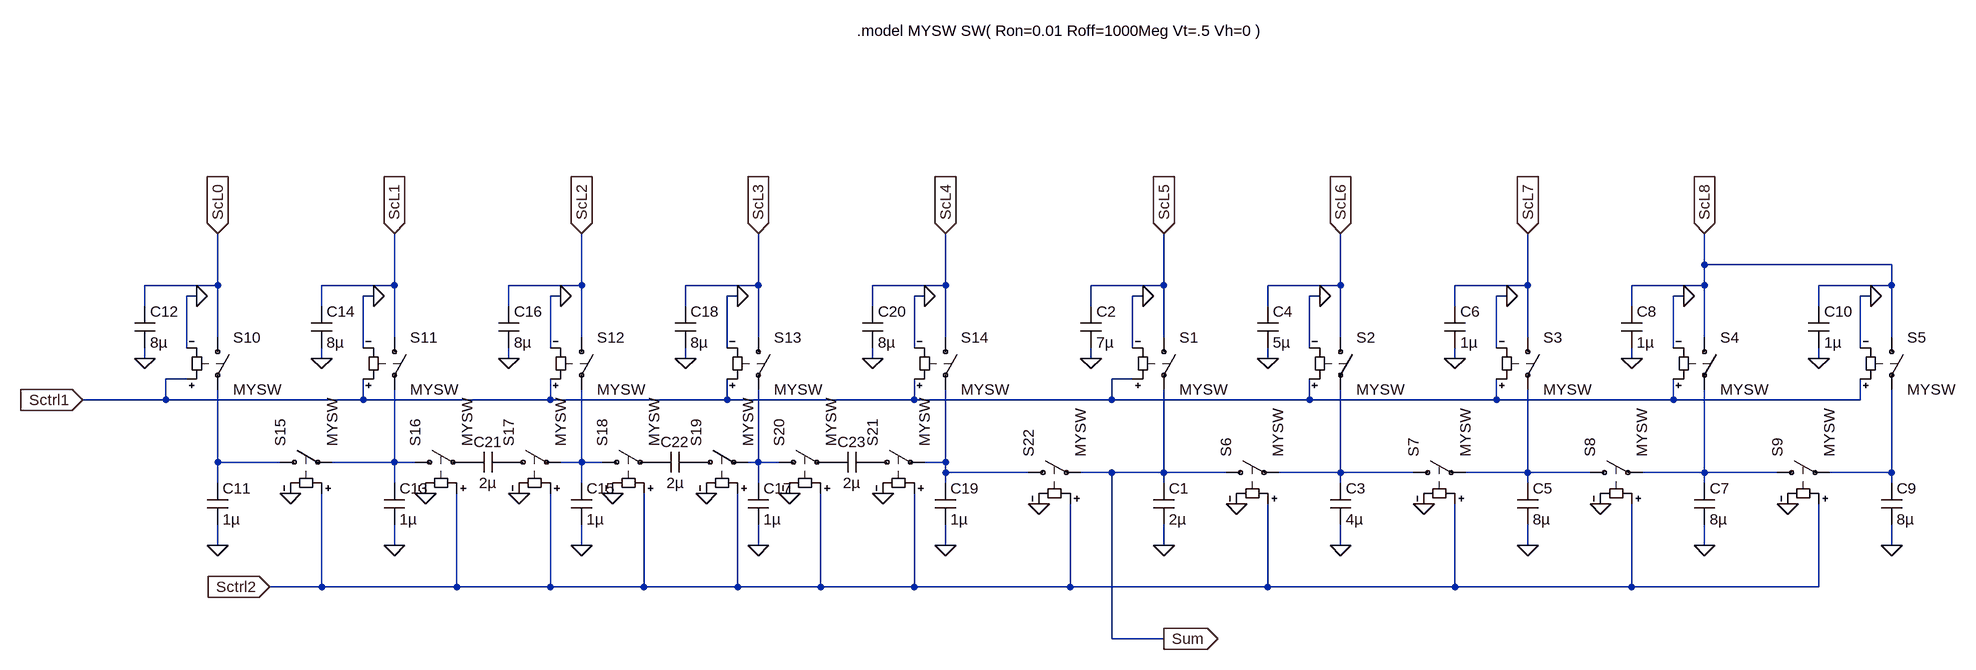
[diagram p0: schematic leafmod.asc]
leafmod.asc, the LTspice schematic file:
Version 4
SHEET 1 1396 680
WIRE 1008 -192 1008 -240
WIRE 1296 -192 1008 -192
WIRE -1280 -160 -1280 -240
WIRE -1280 -160 -1392 -160
WIRE -1008 -160 -1008 -240
WIRE -1008 -160 -1120 -160
WIRE -720 -160 -720 -240
WIRE -720 -160 -832 -160
WIRE -448 -160 -448 -240
WIRE -448 -160 -560 -160
WIRE -160 -160 -160 -240
WIRE -160 -160 -272 -160
WIRE 176 -160 176 -240
WIRE 176 -160 64 -160
WIRE 448 -160 448 -240
WIRE 448 -160 336 -160
WIRE 736 -160 736 -240
WIRE 736 -160 624 -160
WIRE 1008 -160 1008 -192
WIRE 1008 -160 896 -160
WIRE 1296 -160 1296 -192
WIRE 1296 -160 1184 -160
WIRE -1312 -144 -1328 -144
WIRE -1040 -144 -1056 -144
WIRE -752 -144 -768 -144
WIRE -480 -144 -496 -144
WIRE -192 -144 -208 -144
WIRE 144 -144 128 -144
WIRE 416 -144 400 -144
WIRE 704 -144 688 -144
WIRE 976 -144 960 -144
WIRE 1264 -144 1248 -144
WIRE -1392 -128 -1392 -160
WIRE -1120 -128 -1120 -160
WIRE -832 -128 -832 -160
WIRE -560 -128 -560 -160
WIRE -272 -128 -272 -160
WIRE 64 -128 64 -160
WIRE 336 -128 336 -160
WIRE 624 -128 624 -160
WIRE 896 -128 896 -160
WIRE 1184 -128 1184 -160
WIRE -1280 -80 -1280 -160
WIRE -1008 -80 -1008 -160
WIRE -720 -80 -720 -160
WIRE -448 -80 -448 -160
WIRE -160 -80 -160 -160
WIRE 176 -80 176 -160
WIRE 448 -80 448 -160
WIRE 736 -80 736 -160
WIRE 1008 -80 1008 -160
WIRE 1296 -80 1296 -160
WIRE -1328 -64 -1328 -144
WIRE -1056 -64 -1056 -144
WIRE -768 -64 -768 -144
WIRE -496 -64 -496 -144
WIRE -208 -64 -208 -144
WIRE 128 -64 128 -144
WIRE 400 -64 400 -144
WIRE 688 -64 688 -144
WIRE 960 -64 960 -144
WIRE 1248 -64 1248 -144
WIRE -1392 -48 -1392 -64
WIRE -1120 -48 -1120 -64
WIRE -832 -48 -832 -64
WIRE -560 -48 -560 -64
WIRE -272 -48 -272 -64
WIRE 64 -48 64 -64
WIRE 336 -48 336 -64
WIRE 624 -48 624 -64
WIRE 896 -48 896 -64
WIRE 1184 -48 1184 -64
WIRE -1328 -16 -1360 -16
WIRE 128 -16 96 -16
WIRE -1360 16 -1360 -16
WIRE -1360 16 -1488 16
WIRE -1056 16 -1056 -16
WIRE -1056 16 -1360 16
WIRE -768 16 -768 -16
WIRE -768 16 -1056 16
WIRE -496 16 -496 -16
WIRE -496 16 -768 16
WIRE -208 16 -208 -16
WIRE -208 16 -496 16
WIRE 96 16 96 -16
WIRE 96 16 -208 16
WIRE 400 16 400 -16
WIRE 400 16 96 16
WIRE 688 16 688 -16
WIRE 688 16 400 16
WIRE 960 16 960 -16
WIRE 960 16 688 16
WIRE 1248 16 1248 -16
WIRE 1248 16 960 16
WIRE -1280 112 -1280 0
WIRE -1184 112 -1280 112
WIRE -1008 112 -1008 0
WIRE -1008 112 -1104 112
WIRE -976 112 -1008 112
WIRE -720 112 -720 0
WIRE -720 112 -752 112
WIRE -688 112 -720 112
WIRE -448 112 -448 0
WIRE -448 112 -464 112
WIRE -416 112 -448 112
WIRE -160 112 -160 0
WIRE -160 112 -192 112
WIRE -160 128 -160 112
WIRE -32 128 -160 128
WIRE 96 128 48 128
WIRE 176 128 176 0
WIRE 176 128 96 128
WIRE 272 128 176 128
WIRE 448 128 448 0
WIRE 448 128 352 128
WIRE 560 128 448 128
WIRE 736 128 736 0
WIRE 736 128 640 128
WIRE 832 128 736 128
WIRE 1008 128 1008 0
WIRE 1008 128 912 128
WIRE 1120 128 1008 128
WIRE 1296 128 1296 0
WIRE 1296 128 1200 128
WIRE -1280 144 -1280 112
WIRE -1008 144 -1008 112
WIRE -720 144 -720 112
WIRE -448 144 -448 112
WIRE -160 144 -160 128
WIRE 176 144 176 128
WIRE 448 144 448 128
WIRE 736 144 736 128
WIRE 1008 144 1008 128
WIRE 1296 144 1296 128
WIRE -1280 240 -1280 208
WIRE -1008 240 -1008 208
WIRE -720 240 -720 208
WIRE -448 240 -448 208
WIRE -160 240 -160 208
WIRE 176 240 176 208
WIRE 448 240 448 208
WIRE 736 240 736 208
WIRE 1008 240 1008 208
WIRE 1296 240 1296 208
WIRE -1120 304 -1120 160
WIRE -1120 304 -1200 304
WIRE -912 304 -912 160
WIRE -912 304 -1120 304
WIRE -768 304 -768 160
WIRE -768 304 -912 304
WIRE -624 304 -624 160
WIRE -624 304 -768 304
WIRE -480 304 -480 160
WIRE -480 304 -624 304
WIRE -352 304 -352 160
WIRE -352 304 -480 304
WIRE -208 304 -208 160
WIRE -208 304 -352 304
WIRE 32 304 32 176
WIRE 32 304 -208 304
WIRE 336 304 336 176
WIRE 336 304 32 304
WIRE 624 304 624 176
WIRE 624 304 336 304
WIRE 896 304 896 176
WIRE 896 304 624 304
WIRE 1184 304 1184 176
WIRE 1184 304 896 304
WIRE 96 384 96 128
WIRE 176 384 96 384
FLAG 64 -48 0
FLAG 176 240 0
FLAG 144 -144 0
FLAG 336 -48 0
FLAG 448 240 0
FLAG 416 -144 0
FLAG 624 -48 0
FLAG 736 240 0
FLAG 704 -144 0
FLAG 896 -48 0
FLAG 1008 240 0
FLAG 976 -144 0
FLAG 1184 -48 0
FLAG 1296 240 0
FLAG 1264 -144 0
FLAG 288 176 0
FLAG 576 176 0
FLAG 848 176 0
FLAG 1136 176 0
FLAG -1392 -48 0
FLAG -1280 240 0
FLAG -1312 -144 0
FLAG -1120 -48 0
FLAG -1008 240 0
FLAG -1040 -144 0
FLAG -832 -48 0
FLAG -720 240 0
FLAG -752 -144 0
FLAG -560 -48 0
FLAG -448 240 0
FLAG -480 -144 0
FLAG -272 -48 0
FLAG -160 240 0
FLAG -192 -144 0
FLAG -1168 160 0
FLAG -960 160 0
FLAG -816 160 0
FLAG -672 160 0
FLAG -528 160 0
FLAG -400 160 0
FLAG -256 160 0
FLAG -16 176 0
FLAG -1280 -240 ScL0
IOPIN -1280 -240 In
FLAG -1008 -240 ScL1
IOPIN -1008 -240 In
FLAG -720 -240 ScL2
IOPIN -720 -240 In
FLAG -448 -240 ScL3
IOPIN -448 -240 In
FLAG -160 -240 ScL4
IOPIN -160 -240 In
FLAG 176 -240 ScL5
IOPIN 176 -240 In
FLAG 448 -240 ScL6
IOPIN 448 -240 In
FLAG 736 -240 ScL7
IOPIN 736 -240 In
FLAG 1008 -240 ScL8
IOPIN 1008 -240 In
FLAG -1488 16 Sctrl1
IOPIN -1488 16 In
FLAG -1200 304 Sctrl2
IOPIN -1200 304 In
FLAG 176 384 Sum
IOPIN 176 384 Out
SYMBOL cap 160 144 R0
SYMATTR InstName C1
SYMATTR Value 2µ
SYMBOL cap 48 -128 R0
SYMATTR InstName C2
SYMATTR Value 7µ
SYMBOL sw 176 -96 R0
SYMATTR InstName S1
SYMATTR Value MYSW
SYMBOL cap 432 144 R0
SYMATTR InstName C3
SYMATTR Value 4µ
SYMBOL cap 320 -128 R0
SYMATTR InstName C4
SYMATTR Value 5µ
SYMBOL sw 448 -96 R0
SYMATTR InstName S2
SYMATTR Value MYSW
SYMBOL cap 720 144 R0
SYMATTR InstName C5
SYMATTR Value 8µ
SYMBOL cap 608 -128 R0
SYMATTR InstName C6
SYMATTR Value 1µ
SYMBOL sw 736 -96 R0
SYMATTR InstName S3
SYMATTR Value MYSW
SYMBOL cap 992 144 R0
SYMATTR InstName C7
SYMATTR Value 8µ
SYMBOL cap 880 -128 R0
SYMATTR InstName C8
SYMATTR Value 1µ
SYMBOL sw 1008 -96 R0
SYMATTR InstName S4
SYMATTR Value MYSW
SYMBOL cap 1280 144 R0
SYMATTR InstName C9
SYMATTR Value 8µ
SYMBOL cap 1168 -128 R0
SYMATTR InstName C10
SYMATTR Value 1µ
SYMBOL sw 1296 -96 R0
SYMATTR InstName S5
SYMATTR Value MYSW
SYMBOL sw 256 128 R270
SYMATTR InstName S6
SYMATTR Value MYSW
SYMBOL sw 544 128 R270
SYMATTR InstName S7
SYMATTR Value MYSW
SYMBOL sw 816 128 R270
SYMATTR InstName S8
SYMATTR Value MYSW
SYMBOL sw 1104 128 R270
SYMATTR InstName S9
SYMATTR Value MYSW
SYMBOL cap -1296 144 R0
SYMATTR InstName C11
SYMATTR Value 1µ
SYMBOL cap -1408 -128 R0
SYMATTR InstName C12
SYMATTR Value 8µ
SYMBOL sw -1280 -96 R0
SYMATTR InstName S10
SYMATTR Value MYSW
SYMBOL cap -1024 144 R0
SYMATTR InstName C13
SYMATTR Value 1µ
SYMBOL cap -1136 -128 R0
SYMATTR InstName C14
SYMATTR Value 8µ
SYMBOL sw -1008 -96 R0
SYMATTR InstName S11
SYMATTR Value MYSW
SYMBOL cap -736 144 R0
SYMATTR InstName C15
SYMATTR Value 1µ
SYMBOL cap -848 -128 R0
SYMATTR InstName C16
SYMATTR Value 8µ
SYMBOL sw -720 -96 R0
SYMATTR InstName S12
SYMATTR Value MYSW
SYMBOL cap -464 144 R0
SYMATTR InstName C17
SYMATTR Value 1µ
SYMBOL cap -576 -128 R0
SYMATTR InstName C18
SYMATTR Value 8µ
SYMBOL sw -448 -96 R0
SYMATTR InstName S13
SYMATTR Value MYSW
SYMBOL cap -176 144 R0
SYMATTR InstName C19
SYMATTR Value 1µ
SYMBOL cap -288 -128 R0
SYMATTR InstName C20
SYMATTR Value 8µ
SYMBOL sw -160 -96 R0
SYMATTR InstName S14
SYMATTR Value MYSW
SYMBOL sw -1200 112 R270
SYMATTR InstName S15
SYMATTR Value MYSW
SYMBOL sw -992 112 R270
SYMATTR InstName S16
SYMATTR Value MYSW
SYMBOL cap -832 96 R90
WINDOW 0 0 32 VBottom 2
WINDOW 3 32 32 VTop 2
SYMATTR InstName C21
SYMATTR Value 2µ
SYMBOL sw -848 112 R270
SYMATTR InstName S17
SYMATTR Value MYSW
SYMBOL sw -704 112 R270
SYMATTR InstName S18
SYMATTR Value MYSW
SYMBOL cap -544 96 R90
WINDOW 0 0 32 VBottom 2
WINDOW 3 32 32 VTop 2
SYMATTR InstName C22
SYMATTR Value 2µ
SYMBOL sw -560 112 R270
SYMATTR InstName S19
SYMATTR Value MYSW
SYMBOL sw -432 112 R270
SYMATTR InstName S20
SYMATTR Value MYSW
SYMBOL cap -272 96 R90
WINDOW 0 0 32 VBottom 2
WINDOW 3 32 32 VTop 2
SYMATTR InstName C23
SYMATTR Value 2µ
SYMBOL sw -288 112 R270
SYMATTR InstName S21
SYMATTR Value MYSW
SYMBOL sw -48 128 R270
SYMATTR InstName S22
SYMATTR Value MYSW
TEXT -296 -552 Left 2 !.model MYSW SW( Ron=0.01 Roff=1000Meg Vt=.5 Vh=0 )

The netlist it stands for:
* leafmod.asc
C1 Sum 0 2µ
C2 ScL5 0 7µ
S1 ScL5 Sum Sctrl1 0 MYSW
C3 N006 0 4µ
C4 ScL6 0 5µ
S2 ScL6 N006 Sctrl1 0 MYSW
C5 N007 0 8µ
C6 ScL7 0 1µ
S3 ScL7 N007 Sctrl1 0 MYSW
C7 N008 0 8µ
C8 ScL8 0 1µ
S4 ScL8 N008 Sctrl1 0 MYSW
C9 N009 0 8µ
C10 ScL8 0 1µ
S5 ScL8 N009 Sctrl1 0 MYSW
S6 Sum N006 Sctrl2 0 MYSW
S7 N006 N007 Sctrl2 0 MYSW
S8 N007 N008 Sctrl2 0 MYSW
S9 N008 N009 Sctrl2 0 MYSW
C11 N001 0 1µ
C12 ScL0 0 8µ
S10 ScL0 N001 Sctrl1 0 MYSW
C13 N002 0 1µ
C14 ScL1 0 8µ
S11 ScL1 N002 Sctrl1 0 MYSW
C15 N003 0 1µ
C16 ScL2 0 8µ
S12 ScL2 N003 Sctrl1 0 MYSW
C17 N004 0 1µ
C18 ScL3 0 8µ
S13 ScL3 N004 Sctrl1 0 MYSW
C19 N005 0 1µ
C20 ScL4 0 8µ
S14 ScL4 N005 Sctrl1 0 MYSW
S15 N001 N002 Sctrl2 0 MYSW
S16 N002 P001 Sctrl2 0 MYSW
C21 P002 P001 2µ
S17 P002 N003 Sctrl2 0 MYSW
S18 N003 P003 Sctrl2 0 MYSW
C22 P004 P003 2µ
S19 P004 N004 Sctrl2 0 MYSW
S20 N004 P005 Sctrl2 0 MYSW
C23 P006 P005 2µ
S21 P006 N005 Sctrl2 0 MYSW
S22 N005 Sum Sctrl2 0 MYSW
.model MYSW SW( Ron=0.01 Roff=1000Meg Vt=.5 Vh=0 )
.backanno
.end